# EasyEDA schematic schematics.json
TITLE: Garbage Disposal Relay; REV: 1.0; Date: 2018-11-04; Sheet: 1/1; Drawn By: Markus Gutschke
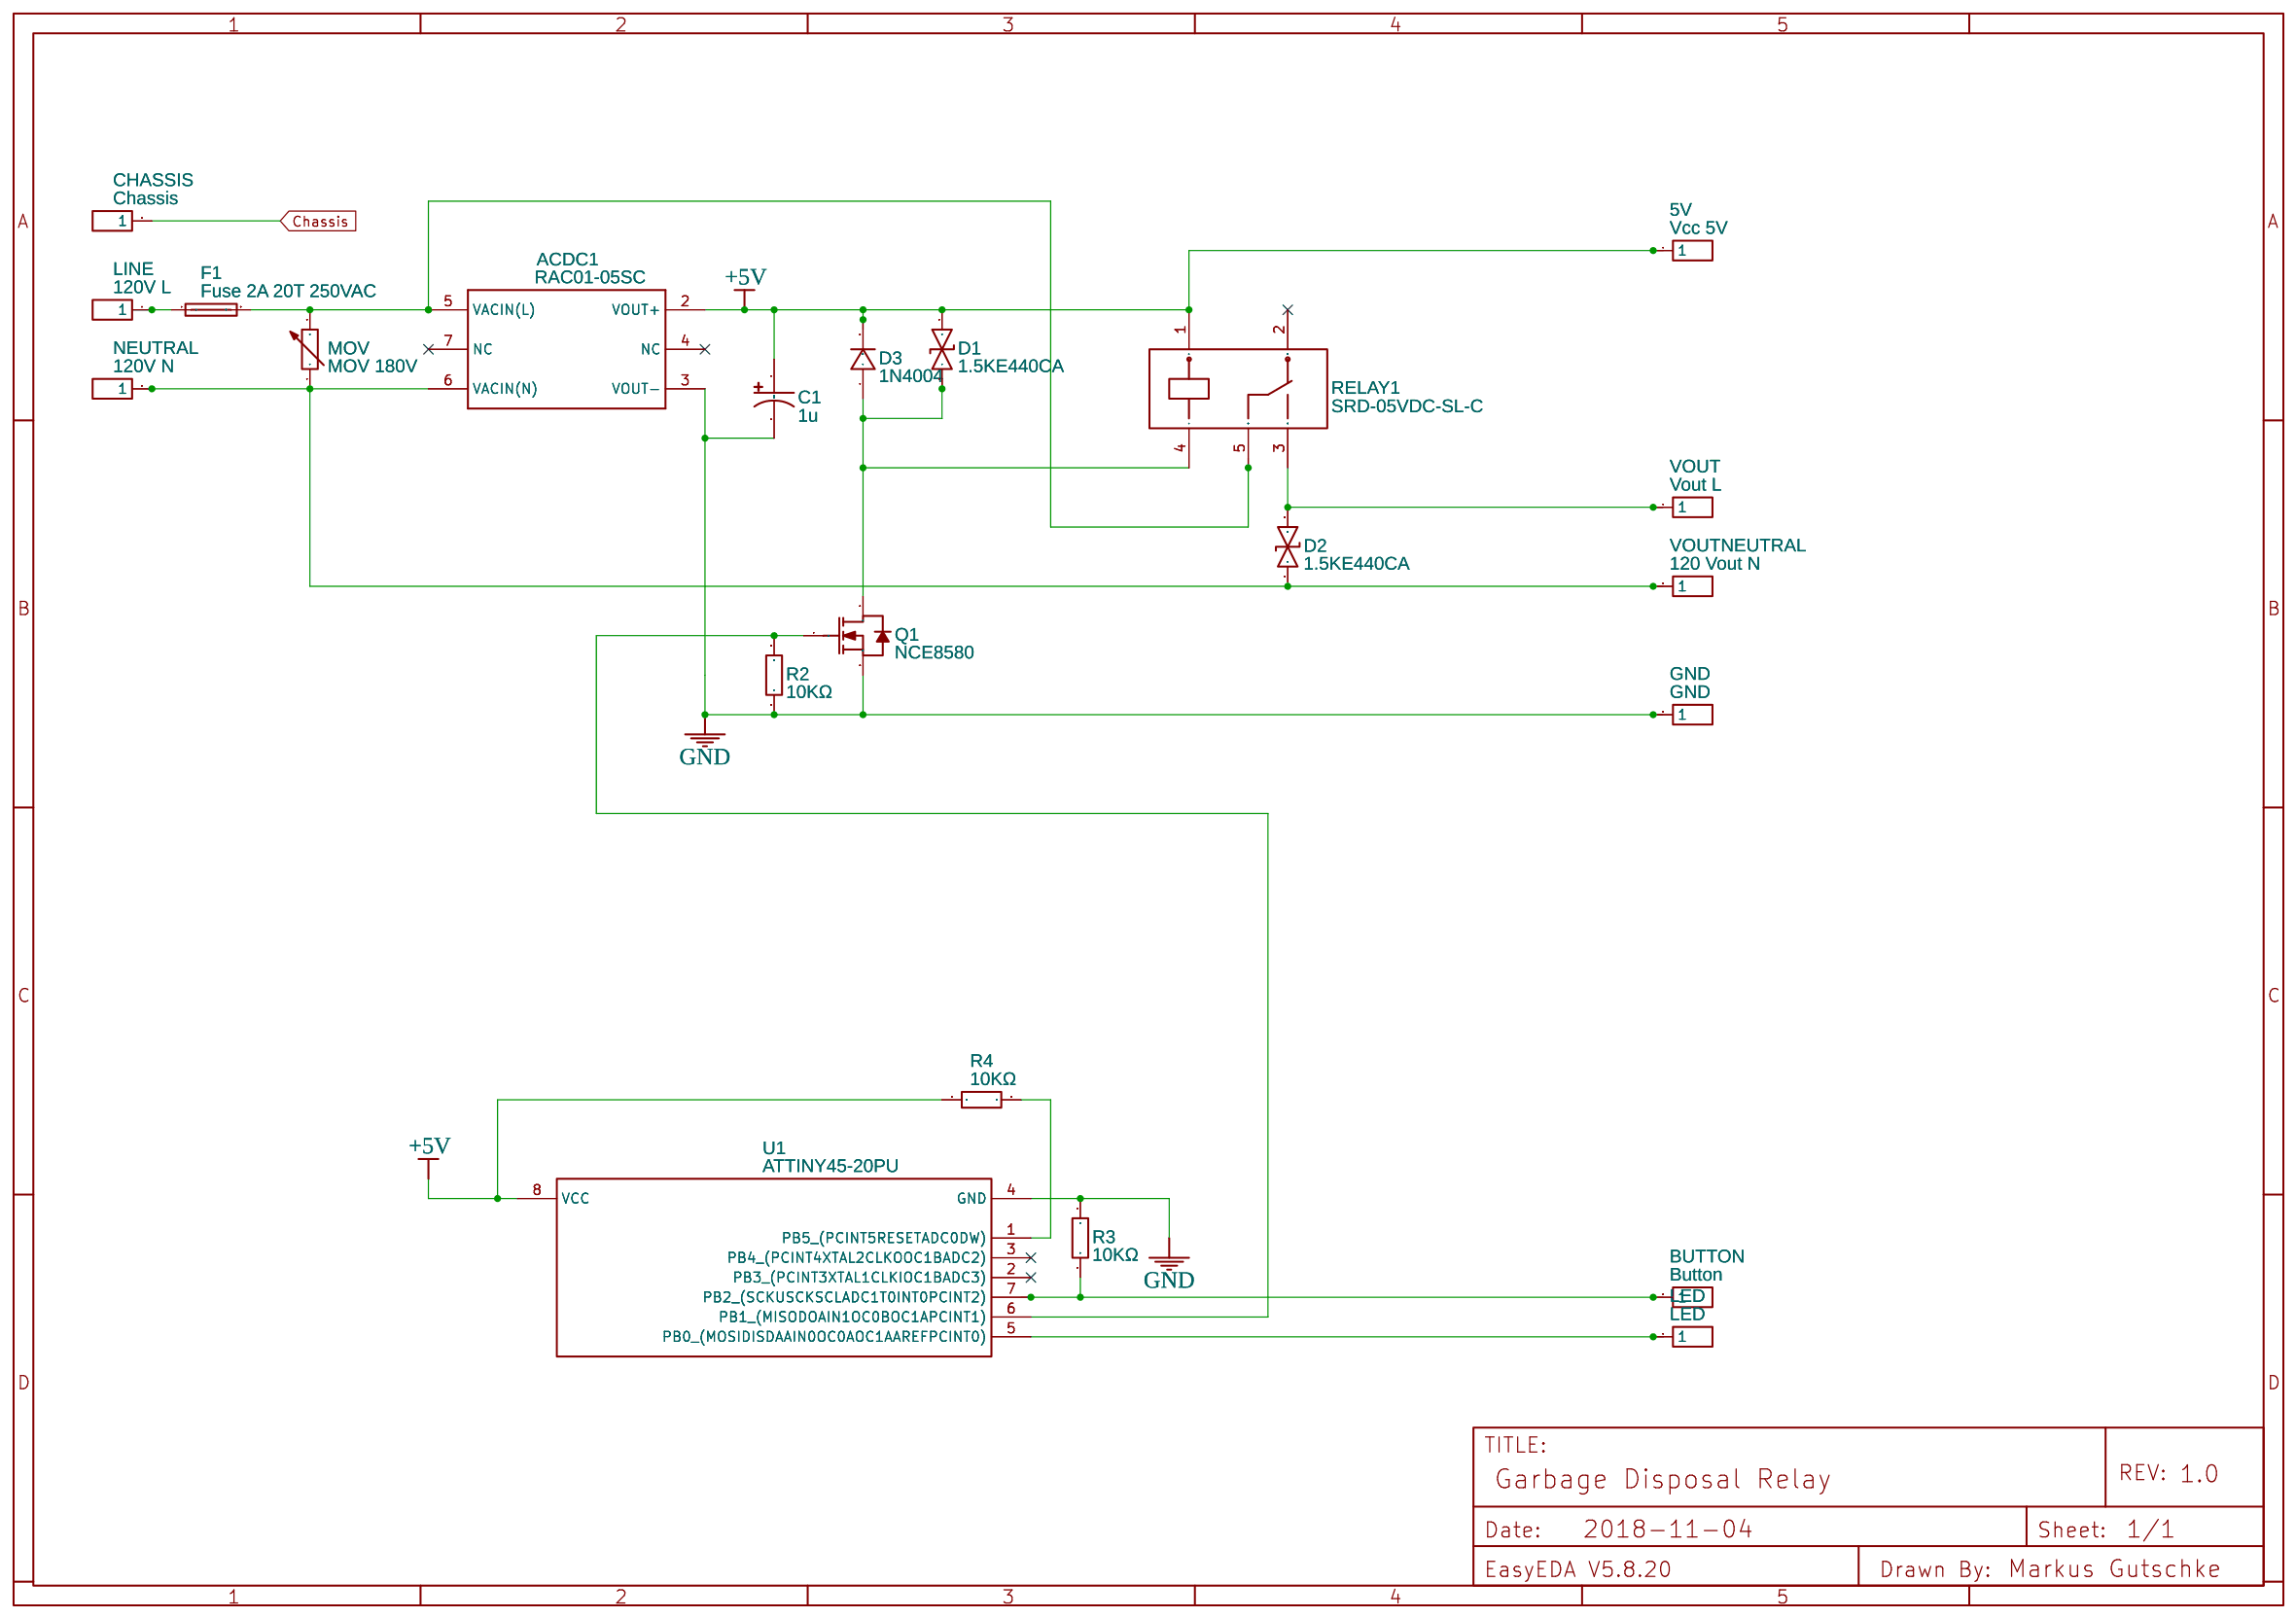
[diagram p0: schematic sheet]

## Parts
5V  Vcc 5V  [HDR-1X1/2.54]
ACDC1  RAC01-05SC  [RAC04-XXSC/277]
BUTTON  Button  [HDR-1X1/2.54]
C1  1u  [CAP-D3.0XF1.5]
CHASSIS  Chassis  [HDR-1X1/2.54]
D1  1.5KE440CA  [DO-201AD-DOB]
D2  1.5KE440CA  [DO-201AD-DOB]
D3  1N4004  [DO-41]
F1  Fuse 2A 20T 250VAC  [FUSE_HOLDER_CQ-2]
GND  GND  [HDR-1X1/2.54]
LED  LED  [HDR-1X1/2.54]
LINE  120V L  [HDR-1X1/2.54]
MOV  MOV 180V  [PS-RES-12.5*5.3]
NEUTRAL  120V N  [HDR-1X1/2.54]
Q1  NCE8580  [TO-220(TO-220-3)]
R2  10KΩ  [AXIAL-0.4]
R3  10KΩ  [AXIAL-0.4]
R4  10KΩ  [AXIAL-0.3]
RELAY1  SRD-05VDC-SL-C  [T9GV1L14-5 TE CONNECTIVITY POTTER &AMP; BRUMFIELD RELAY]
U1  ATTINY45-20PU  [DIP-8]
VOUT  Vout L  [HDR-1X1/2.54]
VOUTNEUTRAL  120 Vout N  [HDR-1X1/2.54]

## Library data of the parts
5V BUTTON CHASSIS GND LED LINE NEUTRAL VOUT VOUTNEUTRAL = -: Supplier Part: A122771-ND; Supplier: Digi-Key; Manufacturer: TE Connectivity AMP Connectors; Manufacturer Part: 1-825433-6
ACDC1 = -: Manufacturer Part: Recom Power; Supplier: Digi-Key; Supplier Part: 945-1064-ND
C1 = Cap_Electrolytic(TH)_D3.0XF1.5_US: Manufacturer Part: TAP105K050SCS; Supplier: Digi-Key; Manufacturer: AVX Corporation; Supplier Part: 478-1836-ND
D1 = -: Supplier Part: 1.5KE6.8CALFCT-ND; Supplier: Digi-Key; Manufacturer: Littelfuse; Manufacturer Part: 1.5KE6.8CA; Contributor: LCSC
D2 = -: Supplier Part: 1.5KE220CA-TPMSCT-ND; Supplier: Digi-Key; Manufacturer: Micro Commercial Co; Manufacturer Part: 1.5KE220CA-TP; Contributor: LCSC
D3 = -: Supplier Part: 1N4004-TPMSCT-ND; Supplier: Digi-Key; Manufacturer: Micro Commercial Co; Manufacturer Part: 1N4004-TP; Contributor: LCSC
F1 = -: Supplier Part: 732-11372-ND; Supplier: Digi-Key; Manufacturer Part: 696103201002; Manufacturer: Wurth Electronics Inc.; image: //image.lceda.cn/szlcsc/C71017.jpg
MOV = B72220S0151K101: Supplier: Digi-Key; Manufacturer Part: MOV-14D471KTR; Manufacturer: Bourns Inc.; Contributor: LCSC; Supplier Part: MOV-14D471KTRCT-ND
Q1 = -: Supplier: Digi-Key; Manufacturer: ON Semiconductor; Manufacturer Part: HUF76423P3; Contributor: LCSC; Supplier Part: HUF76423P3FS-ND
R2 R3 = CFR0W4J0103A50: Supplier: Digi-Key; Manufacturer Part: CFR-25JB-52-10K; Manufacturer: Yageo; Contributor: LCSC; Supplier Part: 10KQBK-ND
R4 = Res_AXIAL-0.3(1/8W)_EU: Manufacturer Part: CFR-25JB-52-10K; Supplier: Digi-Key; Manufacturer: Yageo; Supplier Part: 10KQBK-ND
RELAY1 = -: Supplier Part: PB2362-ND; Supplier: Digi-Key; Manufacturer: RE Connectivity; Manufacturer Part: T9GV1L14-5; image: https://media.digikey.com/Photos/TE%20Connectivity/T9GS1L14_sml.jpg
U1 = -: Supplier: Digi-Key; Manufacturer: MICROCHIP; Contributor: LCSC; Supplier Part: ATTINY45-20PU-ND

## Nets
+5V: 5V.1 ACDC1.2(VOUT+) C1.1 D1.2 D3.2 R4.1 RELAY1.1 U1.8(VCC)
GND: ACDC1.3(VOUT-) C1.2 GND.1 Q1.3(S) R2.1 R3.1 U1.4(GND)
Chassis: CHASSIS.1
ACDC1_5: ACDC1.5(VACIN(L)) F1.2 MOV.2 RELAY1.5
F1_1: F1.1 LINE.1
Net-(ACDC1-6): ACDC1.6(VACIN(N)) D2.1 MOV.1 NEUTRAL.1 VOUTNEUTRAL.1
Net-(D2-2): D2.2 RELAY1.3 VOUT.1
Q1_1: Q1.1(G) R2.2 U1.6(PB1 (MISODOAIN1OC0BOC1APCINT1))
Q1_2: D1.1 D3.1 Q1.2(D) RELAY1.4
R3_2: BUTTON.1 R3.2 U1.7(PB2 (SCKUSCKSCLADC1T0INT0PCINT2))
U1_1: R4.2 U1.1(PB5 (PCINT5RESETADC0DW))
U1_5: LED.1 U1.5(PB0 (MOSIDISDAAIN0OC0AOC1AAREFPCINT0))

Not connected (* = marked no-connect by the designer): ACDC1 4(NC)* 7(NC)*; RELAY1 2*; U1 2(PB3 (PCINT3XTAL1CLKIOC1BADC3))* 3(PB4 (PCINT4XTAL2CLKOOC1BADC2))*
